# Altium schematic sheet Main.SchDoc
size A3; SheetNumber: 1; SheetTotal: 6
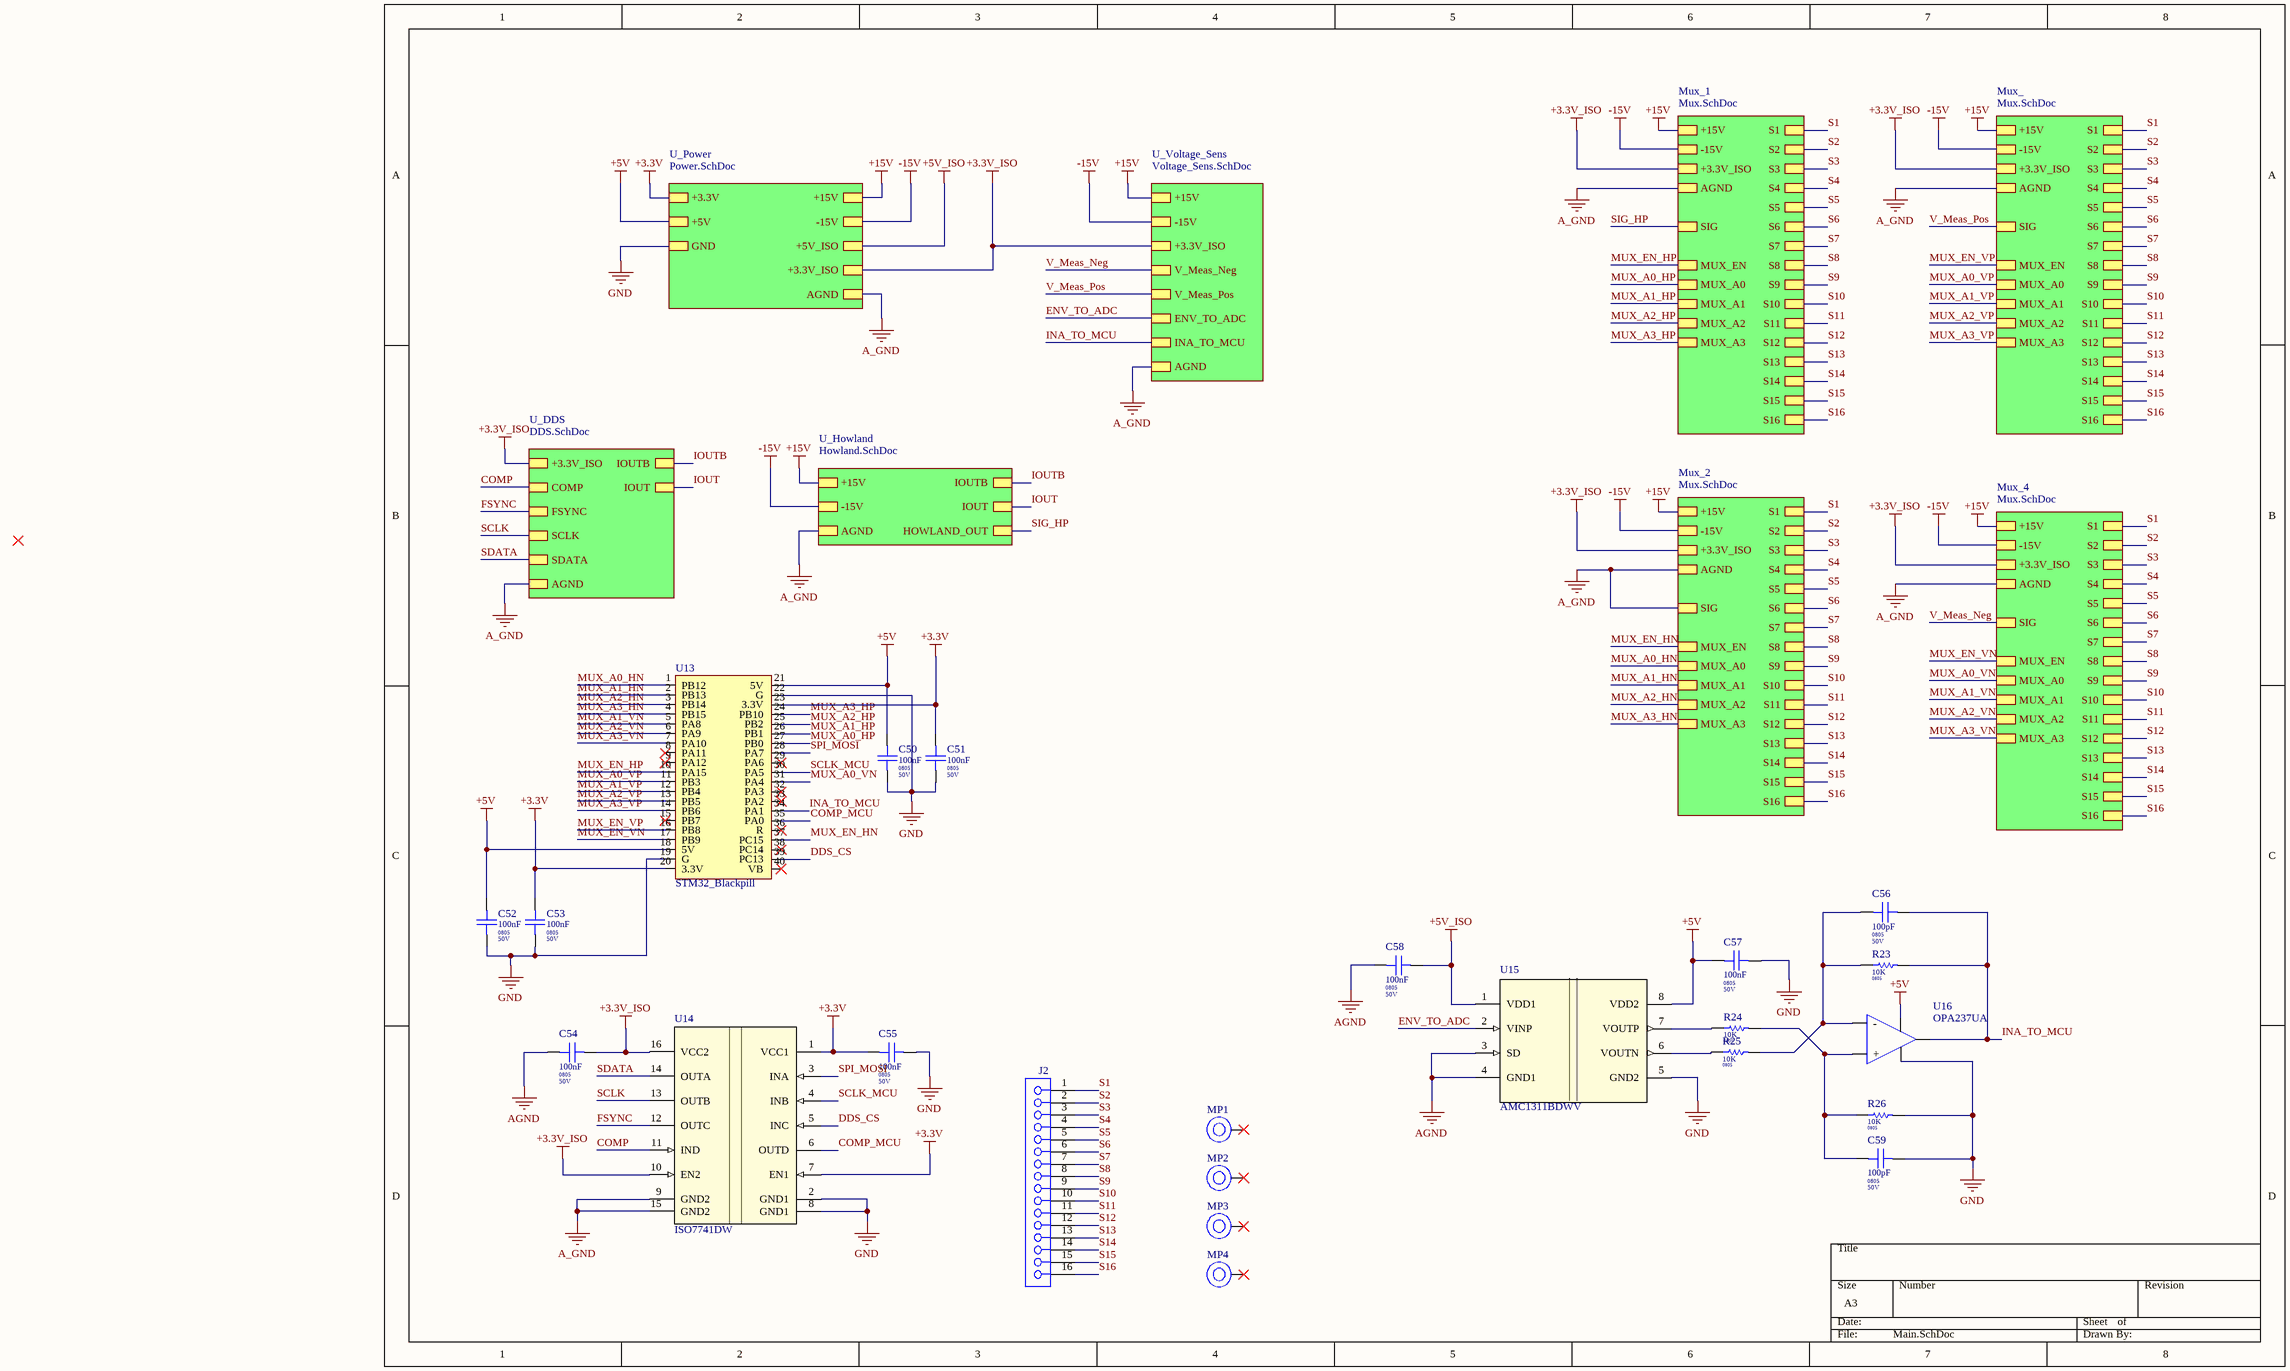
[diagram p0: Main.SchDoc]

## Parts
C50  Package / Case: 0805  Voltage: 50V  [CAPC 0805]  (hidden comment: 100nF)
C51  Package / Case: 0805  Voltage: 50V  [CAPC 0805]  (hidden comment: 100nF)
C52  Package / Case: 0805  Voltage: 50V  [CAPC 0805]  (hidden comment: 100nF)
C53  Package / Case: 0805  Voltage: 50V  [CAPC 0805]  (hidden comment: 100nF)
C54  Package / Case: 0805  Voltage: 50V  [CAPC 0805]  (hidden comment: 100nF)
C55  Package / Case: 0805  Voltage: 50V  [CAPC 0805]  (hidden comment: 100nF)
C56  Package / Case: 0805  Voltage: 50V  [CAPC 0805]  (hidden comment: 100pF)
C57  Package / Case: 0805  Voltage: 50V  [CAPC 0805]  (hidden comment: 100nF)
C58  Package / Case: 0805  Voltage: 50V  [CAPC 0805]  (hidden comment: 100nF)
C59  Package / Case: 0805  Voltage: 50V  [CAPC 0805]  (hidden comment: 100pF)
J2  61301611821  [61301611821]  (value not drawn)
MP1  M3 x 15mm  [78614150360]  (value not drawn)
MP2  M3 x 15mm  [78614150360]  (value not drawn)
MP3  M3 x 15mm  [78614150360]  (value not drawn)
MP4  M3 x 15mm  [78614150360]  (value not drawn)
R23  Package / Case: 0805  [RESC 0805]  (hidden comment: 10K)
R24  Package / Case: 0805  [RESC 0805]  (hidden comment: 10K)
R25  Package / Case: 0805  [RESC 0805]  (hidden comment: 10K)
R26  Package / Case: 0805  [RESC 0805]  (hidden comment: 10K)
U13  STM32_Blackpill  [STM32_Blackpıll]
U14  ISO7741DW  [DW0016B_M]
U15  AMC1311BDWV  [DWV0008A]
U16  OPA237UA  [SOIC127P599X175-8N]

## Sub-sheets
Mux_ = Mux.SchDoc: +15V, -15V, AGND, +3.3V_ISO, S16, S15, S14, S13, S12, S11, S10, S9, S8, S7, S6, S5, S4, S3, S2, S1, SIG, MUX_EN, MUX_A0, MUX_A1, MUX_A2, MUX_A3
Mux_1 = Mux.SchDoc: +15V, -15V, AGND, +3.3V_ISO, S16, S15, S14, S13, S12, S11, S10, S9, S8, S7, S6, S5, S4, S3, S2, S1, SIG, MUX_EN, MUX_A0, MUX_A1, MUX_A2, MUX_A3
Mux_2 = Mux.SchDoc: +15V, -15V, AGND, +3.3V_ISO, S16, S15, S14, S13, S12, S11, S10, S9, S8, S7, S6, S5, S4, S3, S2, S1, SIG, MUX_EN, MUX_A0, MUX_A1, MUX_A2, MUX_A3
Mux_4 = Mux.SchDoc: +15V, -15V, AGND, +3.3V_ISO, S16, S15, S14, S13, S12, S11, S10, S9, S8, S7, S6, S5, S4, S3, S2, S1, SIG, MUX_EN, MUX_A0, MUX_A1, MUX_A2, MUX_A3
U_DDS = DDS.SchDoc: +3.3V_ISO, AGND, IOUTB, IOUT, COMP, FSYNC, SCLK, SDATA
U_Howland = Howland.SchDoc: +15V, -15V, AGND, IOUTB, IOUT, HOWLAND_OUT
U_Power = Power.SchDoc: +3.3V, +15V, -15V, GND, AGND, +5V, +3.3V_ISO, +5V_ISO
U_Voltage_Sens = Voltage_Sens.SchDoc: +15V, -15V, AGND, +3.3V_ISO, V_Meas_Neg, V_Meas_Pos, ENV_TO_ADC, INA_TO_MCU

## Nets
+3.3V: C51.2 C53.2 C55.2 U13.20(3.3V) U13.23(3.3V) U14.1(VCC1) U14.7(EN1) ; sheet U_Power/+3.3V
+3.3V_ISO: C54.1 U14.10(EN2) U14.16(VCC2) ; sheet U_DDS/+3.3V_ISO, sheet U_Power/+3.3V_ISO, sheet U_Voltage_Sens/+3.3V_ISO, sheet Mux_1/+3.3V_ISO, sheet Mux_2/+3.3V_ISO, sheet Mux_/+3.3V_ISO, sheet Mux_4/+3.3V_ISO
+5V: C50.2 C52.2 C57.2 U13.18(5V) U13.21(5V) U15.8(VDD2) U16.7(V+) ; sheet U_Power/+5V
+5V_ISO: C58.1 U15.1(VDD1) ; sheet U_Power/+5V_ISO
+15V: sheet U_Howland/+15V, sheet U_Power/+15V, sheet U_Voltage_Sens/+15V, sheet Mux_1/+15V, sheet Mux_2/+15V, sheet Mux_/+15V, sheet Mux_4/+15V
-15V: sheet U_Howland/-15V, sheet U_Power/-15V, sheet U_Voltage_Sens/-15V, sheet Mux_1/-15V, sheet Mux_2/-15V, sheet Mux_/-15V, sheet Mux_4/-15V
A_GND: U14.9(GND2) U14.15(GND2) ; sheet U_DDS/AGND, sheet U_Howland/AGND, sheet U_Power/AGND, sheet U_Voltage_Sens/AGND, sheet Mux_1/AGND, sheet Mux_2/AGND, sheet Mux_2/SIG, sheet Mux_/AGND, sheet Mux_4/AGND
AGND: C54.2 C58.2 U15.3(SD) U15.4(GND1)
GND: C50.1 C51.1 C52.1 C53.1 C55.1 C57.1 C59.2 R26.1 U13.19(G) U13.22(G) U14.2(GND1) U14.8(GND1) U15.5(GND2) U16.4(V-) ; sheet U_Power/GND
COMP: U14.11(IND) ; sheet U_DDS/COMP
COMP_MCU: U13.35(PA0) U14.6(OUTD)
DDS_CS: U13.39(PC13) U14.5(INC)
ENV_TO_ADC: U15.2(VINP) ; sheet U_Voltage_Sens/ENV_TO_ADC
FSYNC: U14.12(OUTC) ; sheet U_DDS/FSYNC
INA_TO_MCU: C56.2 R23.1 U13.34(PA1) U16.6(Vout) ; sheet U_Voltage_Sens/INA_TO_MCU
IOUT: sheet U_DDS/IOUT, sheet U_Howland/IOUT
IOUTB: sheet U_DDS/IOUTB, sheet U_Howland/IOUTB
MUX_A0_HN: U13.1(PB12) ; sheet Mux_2/MUX_A0
MUX_A0_HP: U13.27(PB0) ; sheet Mux_1/MUX_A0
MUX_A0_VN: U13.31(PA4) ; sheet Mux_4/MUX_A0
MUX_A0_VP: U13.11(PB3) ; sheet Mux_/MUX_A0
MUX_A1_HN: U13.2(PB13) ; sheet Mux_2/MUX_A1
MUX_A1_HP: U13.26(PB1) ; sheet Mux_1/MUX_A1
MUX_A1_VN: U13.5(PA8) ; sheet Mux_4/MUX_A1
MUX_A1_VP: U13.12(PB4) ; sheet Mux_/MUX_A1
MUX_A2_HN: U13.3(PB14) ; sheet Mux_2/MUX_A2
MUX_A2_HP: U13.25(PB2) ; sheet Mux_1/MUX_A2
MUX_A2_VN: U13.6(PA9) ; sheet Mux_4/MUX_A2
MUX_A2_VP: U13.13(PB5) ; sheet Mux_/MUX_A2
MUX_A3_HN: U13.4(PB15) ; sheet Mux_2/MUX_A3
MUX_A3_HP: U13.24(PB10) ; sheet Mux_1/MUX_A3
MUX_A3_VN: U13.7(PA10) ; sheet Mux_4/MUX_A3
MUX_A3_VP: U13.14(PB6) ; sheet Mux_/MUX_A3
MUX_EN_HN: U13.37(PC15) ; sheet Mux_2/MUX_EN
MUX_EN_HP: U13.10(PA15) ; sheet Mux_1/MUX_EN
MUX_EN_VN: U13.17(PB9) ; sheet Mux_4/MUX_EN
MUX_EN_VP: U13.16(PB8) ; sheet Mux_/MUX_EN
S1: J2.1 ; sheet Mux_1/S1, sheet Mux_2/S1, sheet Mux_/S1, sheet Mux_4/S1
S2: J2.2 ; sheet Mux_1/S2, sheet Mux_2/S2, sheet Mux_/S2, sheet Mux_4/S2
S3: J2.3 ; sheet Mux_1/S3, sheet Mux_2/S3, sheet Mux_/S3, sheet Mux_4/S3
S4: J2.4 ; sheet Mux_1/S4, sheet Mux_2/S4, sheet Mux_/S4, sheet Mux_4/S4
S5: J2.5 ; sheet Mux_1/S5, sheet Mux_2/S5, sheet Mux_/S5, sheet Mux_4/S5
S6: J2.6 ; sheet Mux_1/S6, sheet Mux_2/S6, sheet Mux_/S6, sheet Mux_4/S6
S7: J2.7 ; sheet Mux_1/S7, sheet Mux_2/S7, sheet Mux_/S7, sheet Mux_4/S7
S8: J2.8 ; sheet Mux_1/S8, sheet Mux_2/S8, sheet Mux_/S8, sheet Mux_4/S8
S9: J2.9 ; sheet Mux_1/S9, sheet Mux_2/S9, sheet Mux_/S9, sheet Mux_4/S9
S10: J2.10 ; sheet Mux_1/S10, sheet Mux_2/S10, sheet Mux_/S10, sheet Mux_4/S10
S11: J2.11 ; sheet Mux_1/S11, sheet Mux_2/S11, sheet Mux_/S11, sheet Mux_4/S11
S12: J2.12 ; sheet Mux_1/S12, sheet Mux_2/S12, sheet Mux_/S12, sheet Mux_4/S12
S13: J2.13 ; sheet Mux_1/S13, sheet Mux_2/S13, sheet Mux_/S13, sheet Mux_4/S13
S14: J2.14 ; sheet Mux_1/S14, sheet Mux_2/S14, sheet Mux_/S14, sheet Mux_4/S14
S15: J2.15 ; sheet Mux_1/S15, sheet Mux_2/S15, sheet Mux_/S15, sheet Mux_4/S15
S16: J2.16 ; sheet Mux_1/S16, sheet Mux_2/S16, sheet Mux_/S16, sheet Mux_4/S16
SCLK: U14.13(OUTB) ; sheet U_DDS/SCLK
SCLK_MCU: U13.30(PA5) U14.4(INB)
SDATA: U14.14(OUTA) ; sheet U_DDS/SDATA
SIG_HP: sheet U_Howland/HOWLAND_OUT, sheet Mux_1/SIG
SPI_MOSI: U13.28(PA7) U14.3(INA)
V_Meas_Neg: sheet U_Voltage_Sens/V_Meas_Neg, sheet Mux_4/SIG
V_Meas_Pos: sheet U_Voltage_Sens/V_Meas_Pos, sheet Mux_/SIG
NetC56_1: C56.1 R23.2 R25.1 U16.2(-)
NetC59_1: C59.1 R24.1 R26.2 U16.3(+)
NetR24_2: R24.2 U15.7(VOUTP)
NetR25_2: R25.2 U15.6(VOUTN)

Not connected (* = marked no-connect by the designer): MP1 1*; MP2 1*; MP3 1*; MP4 1*; U13 8(PA11)* 9(PA12)* 15(PB7)* 29(PA6)* 32(PA3)* 33(PA2)* 36(R)* 38(PC14)* 40(VB)*

## Library data of the parts
C50-C55 C57 C58 = CAPC0572: Capacitor Ceramic 100nF 50V 0805; Tolerance: %10; Value Rating: nF; Favorites: Favorite; Value: 100nF; Part Number: CAPC0572; Category: Capacitor Ceramic; Values: 100nF 50V
C56 C59 = CAPC0548: Capacitor Ceramic 100pF 50V 0805; Tolerance: %10; Value Rating: pF; Value: 100pF; Part Number: CAPC0548; Category: Capacitor Ceramic; Values: 100pF 50V
J2 = 61301611821: WR-PHD Socket Header, THT, Vertical, pitch 2.54mm, 1 Row, 16P; Manufacturer: Wurth Elektronik; Contact Resistance: 20mOhm; Rated Current: 3A; Working Voltage: 250V; Withstanding Voltage: 500V; Manufacturer Part Number: 61301611821; Category: Board-to-Board Connectors; Match Code: WR-PHD; ComponentLink1Description: Website Link; ComponentLink1URL: https://www.we-online.com/redexpert/article/61301611821?ad; ComponentLink2Description: Datasheet Link; ComponentLink2URL: https://www.we-online.com/redexpert/spec/61301611821?ad; Mount: Through Hole; Min Operating Temperature: -40°C; Max Operating Temperature: 105°C; Packaging: Tray; Gender: Socket Header; Number of Pins: 16; Number of Rows: 1; Orientation: Vertical; Lead Pitch: 2.54mm
MP1-MP4 = 78614150360: WA-SMSA SMT Spacer Studs Automotive, OD 6mm, ID 4.2mm, M3 x 15mm; Manufacturer: Wurth Elektronik; Surface: Tin; Solder Cream Thickness Min: 150um; Tightenning Torque Max: 0.5N*m; Manufacturer Part Number: 78614150360; Category: SMT Spacers; Match Code: WA-SMSA; ComponentLink1Description: Website Link; ComponentLink1URL: https://www.we-online.com/redexpert/article/78614150360?ad; ComponentLink2Description: Datasheet Link; ComponentLink2URL: https://www.we-online.com/redexpert/spec/78614150360?ad; Mount: Surface Mount; Min Operating Temperature: -55°C; Max Operating Temperature: 150°C; Packaging: Tape and Reel; Height: 15mm; Automotive: Yes; Inside Diameter: 4.2mm; Material: Steel; Outside Diameter: 6mm; Thread Size: M3
R23-R26 = R0366: 10K 0805; Part Number: R0366; Tolerance: %5; Power: 1/10W; Value: 10K; Category: Resistor; Values: 10K
U14 = ISO7741DW: Robust EMC, quad-channel, 3/1, reinforced digital isolator 16-SOIC -55 to 125; Manufacturer_Name: Texas Instruments; TYPE: TYPE; RefDes: RefDes; Copyright: Copyright (C) 2026 Ultra Librarian. All rights reserved.; Manufacturer_Part_Number: ISO7741DW
U15 = AMC1311BDWV: 2-V input, precision voltage sensing reinforced isolated amplifier 8-SOIC -55 to 125; Manufacturer_Name: Texas Instruments; TYPE: TYPE; RefDes: RefDes; Copyright: Copyright (C) 2025 Ultra Librarian. All rights reserved.; Manufacturer_Part_Number: AMC1311BDWV
U16 = OPA237UA: Single-Supply Operational Amplifiers MicroAmplifier™ Series 8-SOIC -40 to 70; Manufacturer: Texas Instruments; Bandwidth: 1.5MHz; Unity Gain Bandwidth Product: 1.4MHz; Min Supply Voltage: 2.7V; Max Supply Voltage: 36V; Nominal Supply Current: 475uA; Voltage Gain: 88dB; Common Mode Rejection Ratio: 78dB; Number of Channels: 1; Slew Rate: 0.5V/µs; Max I/O Voltage: 750uV; Input Bias Current: 40nA; Operating Supply Current: 200uA; Power Supply Rejection Ratio (PSRR): 100dB; Output Current per Channel: 8mA; Operating Supply Voltage: 5V; Dual Supply Voltage: 15V; Min Dual Supply Voltage: 1.35V; Max Dual Supply Voltage: 18V; Supplier 1: Digi-Key; Manufacturer Part Number: OPA237UA; RoHS: Yes; Category: Amplifiers - Op Amps, Buffer, Instrumentation; Stock 1: 186; Pricing 1: 1=2,06000, 10=1,85400, 25=1,74880, 100=1,49010, 250=1,39920, 500=1,22430, 1000=1,15500 (USD); Case/Package: D; Number of Pins: 8; Min Operating Temperature: -40°C; Max Operating Temperature: 70°C; Package Quantity: 75; Packaging: Rail/Tube; Number of Circuits: 1; Gain Bandwidth Product: 1.4MHz; Input Offset Voltage (Vos): 750uV; Number of Elements: 1; Number of Amplifiers: 1; Nominal Gain Bandwidth Product: 1.4MHz; Length: 4.9mm; Width: 3.91mm; Height: 1.58mm; Radiation Hardening: No; Lead Free: Lead Free; REACH SVHC: No SVHC; ComponentLink1URL: https://datasheet.ciiva.com/7684/1789011-7684483.pdf?src-supplier=Element14; ComponentLink1Description: https://datasheet.ciiva.com/7684/1789011-7684483.pdf?src-supplier=Element14; ComponentLink2URL: https://datasheet.ciiva.com/22729/1716473-22729883.pdf?src-supplier=Element14; ComponentLink2Description: https://datasheet.ciiva.com/22729/1716473-22729883.pdf?src-supplier=Element14; ComponentLink3URL: https://datasheet.ciiva.com/2973/sbos057a-2973962.pdf?src-supplier=Avnet; ComponentLink3Description: https://datasheet.ciiva.com/2973/sbos057a-2973962.pdf?src-supplier=Avnet; ComponentLink4URL: https://datasheet.ciiva.com/26243/sbos057a-26243614.pdf?src-supplier=Avnet+Europe; ComponentLink4Description: https://datasheet.ciiva.com/26243/sbos057a-26243614.pdf?src-supplier=Avnet+Europe; ComponentLink5URL: https://datasheet.ciiva.com/1803/opa2237-1803652.pdf?src-supplier=Digi-Key; ComponentLink5Description: https://datasheet.ciiva.com/1803/opa2237-1803652.pdf?src-supplier=Digi-Key; ComponentLink6URL: https://datasheet.ciiva.com/48707/001011214-da-01-en-ic-opamp-gp-1-5mhz-s-opa237ua-soic-8-tid-48707210.pdf?src-supplier=Conrad; ComponentLink6Description: https://datasheet.ciiva.com/48707/001011214-da-01-en-ic-opamp-gp-1-5mhz-s-opa237ua-soic-8-tid-48707210.pdf?src-supplier=Conrad; Supplier Part Number 1: OPA237UA-ND